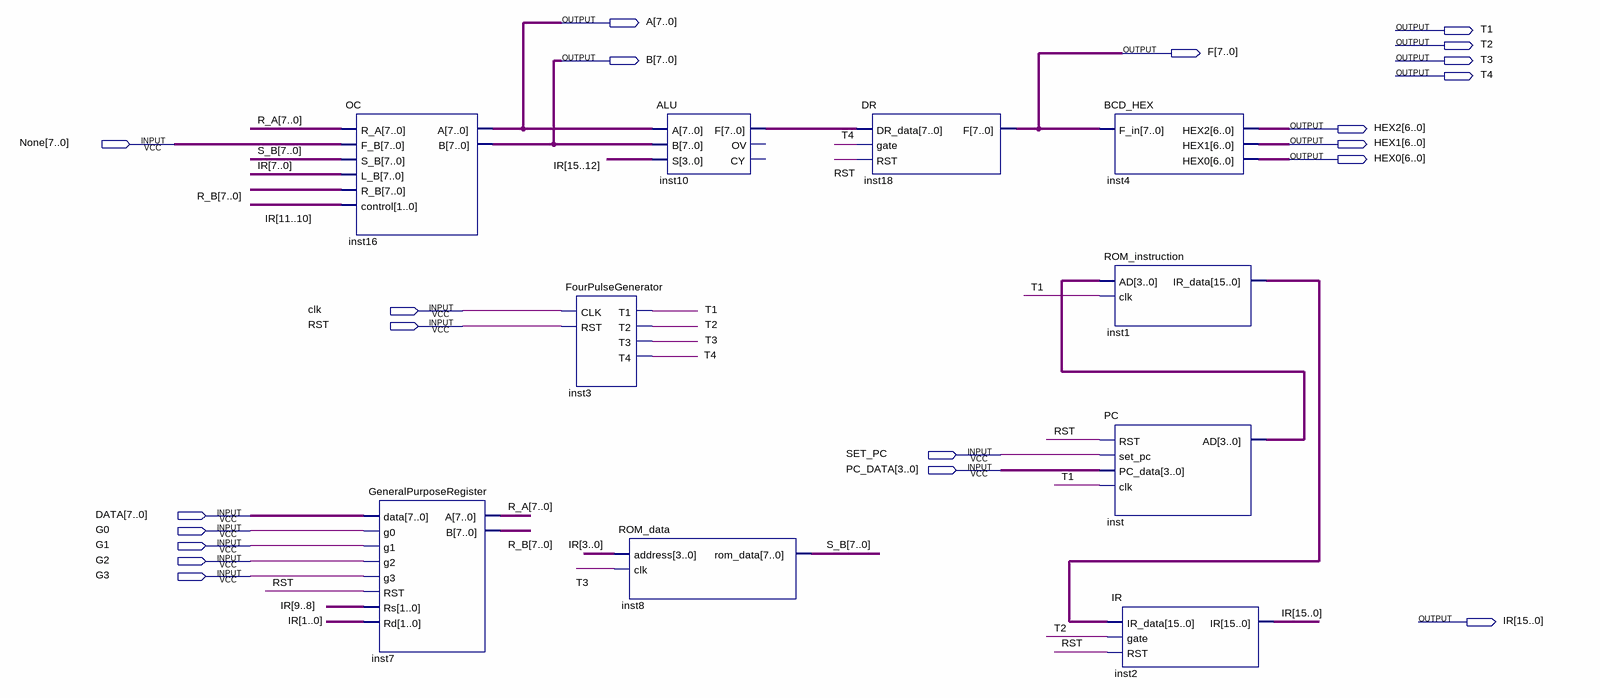
[diagram p0: schematic sheet]
// Quartus schematic CPU.bdf as structural Verilog: 10 symbols, 21 pins
module CPU (
  input  [7:0] None,
  input  clk,
  input  RST,
  input  SET_PC,
  input  [3:0] PC_DATA,
  input  [7:0] DATA,
  input  G0,
  input  G1,
  input  G2,
  input  G3,
  output [7:0] A,
  output T1,
  output T2,
  output [7:0] F,
  output [7:0] B,
  output T3,
  output T4,
  output [6:0] HEX2,
  output [6:0] HEX1,
  output [6:0] HEX0,
  output [15:0] IR
);

  wire [3:0] inst_ad;
  wire [7:0] inst10_f, R_A, R_B, S_B;
  wire [15:0] inst1_ir_data;

  OC inst16 (.R_A(R_A), .F_B(None), .S_B(S_B), .L_B(IR[7:0]), .R_B(R_B), .control(IR[11:10]), .A(A), .B(B));
  GeneralPurposeRegister inst7 (
    .data(DATA), .g0(G0), .g1(G1), .g2(G2), .g3(G3), .RST(RST), .Rs(IR[9:8]), .Rd(IR[1:0]), .A(R_A), .B(R_B));
  FourPulseGenerator inst3 (.CLK(clk), .RST(RST), .T1(T1), .T2(T2), .T3(T3), .T4(T4));
  ROM_data inst8 (.address(IR[3:0]), .clk(T3), .rom_data(S_B));
  ALU inst10 (.A(A), .B(B), .S(IR[15:12]), .F(inst10_f));  // open: OV, CY
  DR inst18 (.DR_data(inst10_f), .gate(T4), .RST(RST), .F(F));
  BCD_HEX inst4 (.F_in(F), .HEX2(HEX2), .HEX1(HEX1), .HEX0(HEX0));
  ROM_instruction inst1 (.AD(inst_ad), .clk(T1), .IR_data(inst1_ir_data));
  PC inst (.RST(RST), .set_pc(SET_PC), .PC_data(PC_DATA), .clk(T1), .AD(inst_ad));
  IR inst2 (.IR_data(inst1_ir_data), .gate(T2), .RST(RST), .IR(IR));
endmodule
